# EAGLE design TestShem (EAGLE 9.6.2)
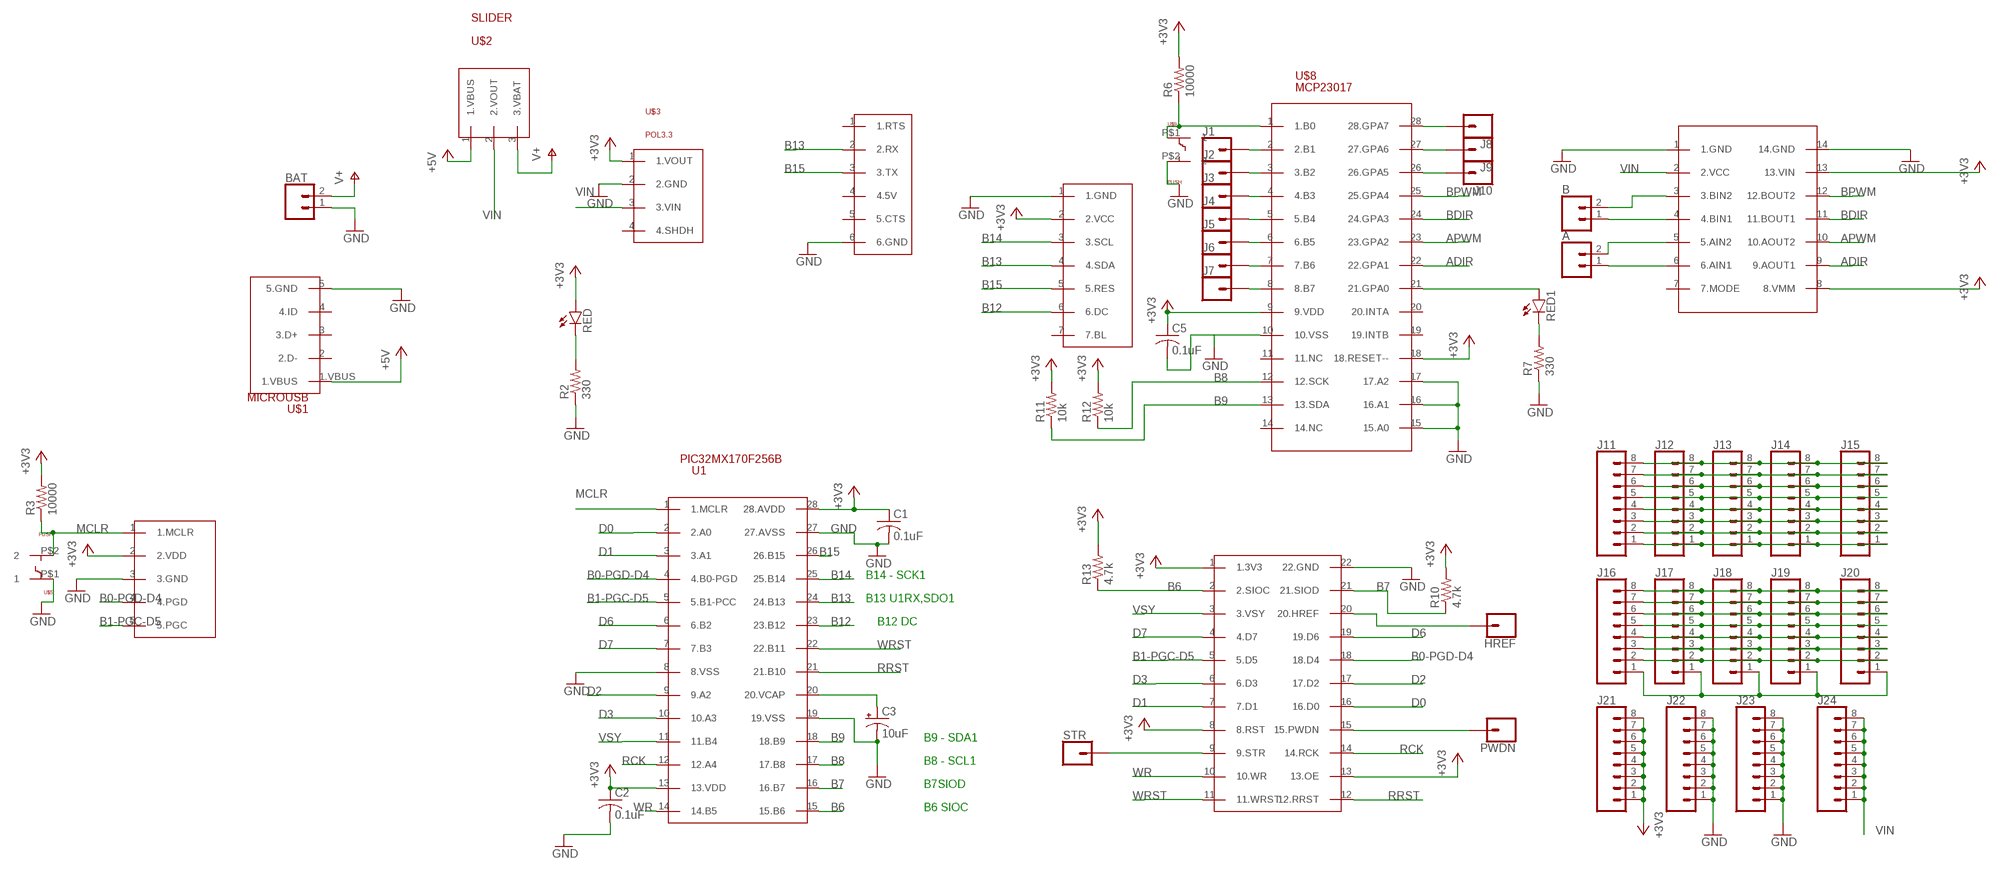
[diagram p0: schematic, sheet 1]

## Parts
A  CONN_02  [1X02]
B  CONN_02  [1X02]
BAT  CONN_02  [1X02]
C1  0.1uF  C-US025-030X050  [C025-030X050]
C2  0.1uF  C-US025-030X050  [C025-030X050]
C3  10uF  CPOL-USB45181B  [B45181B]
C5  0.1uF  C-US025-030X050  [C025-030X050]
HREF  CONN_01  [1X01]
J1  CONN_01  [1X01]
J2  CONN_01  [1X01]
J3  CONN_01  [1X01]
J4  CONN_01  [1X01]
J5  CONN_01  [1X01]
J6  CONN_01  [1X01]
J7  CONN_01  [1X01]
J8  CONN_01  [1X01]
J9  CONN_01  [1X01]
J10  CONN_01  [1X01]
J11  CONN_08"  [1X08]
J12  CONN_08"  [1X08]
J13  CONN_08"  [1X08]
J14  CONN_08"  [1X08]
J15  CONN_08"  [1X08]
J16  CONN_08"  [1X08]
J17  CONN_08"  [1X08]
J18  CONN_08"  [1X08]
J19  CONN_08"  [1X08]
J20  CONN_08"  [1X08]
J21  CONN_08"  [1X08]
J22  CONN_08"  [1X08]
J23  CONN_08"  [1X08]
J24  CONN_08"  [1X08]
PWDN  CONN_01  [1X01]
R2  330  R-US_0207/10  [0207/10]
R3  10000  R-US_0207/10  [0207/10]
R6  10000  R-US_0207/10  [0207/10]
R7  330  R-US_0207/10  [0207/10]
R10  4.7k  R-US_0207/10  [0207/10]
R11  10k  R-US_0207/10  [0207/10]
R12  10k  R-US_0207/10  [0207/10]
R13  4.7k  R-US_0207/10  [0207/10]
RED  LED3MM  [LED3MM]
RED1  LED3MM  [LED3MM]
STR  CONN_01  [1X01]
U1  PIC32MX170F256B  [DIL28-3]
U$1  MICROUSB  [MICROUSB]
U$2  SLIDER  [SLIDER]
U$3  POL3.3  [POLOLU3.3]
U$4  SNAP  [1X05]
U$5  PUSH  [PUSH]
U$6  ADACP2104  [1X06V2]
U$7  ST7789  [1X07]
U$8  MCP23017  [DIL28-3]
U$9  PUSH  [PUSH]
U$10  POLOLUDRV8835V2  [1X07V2]
U$11  OV7670CAMFIXED  [1X02CAM]

## Nets
10.VSS: C5.2 U$8.10(10.VSS)
+3V3: C1.1 C2.1 C5.1 J21.1 J21.2 J21.3 J21.4 J21.5 J21.6 J21.7 J21.8 R3.2 R6.2 R10.2 R11.2 R12.2 R13.2 RED.A U1.13(13.VDD) U1.28(28.AVDD) U$3.1(1.VOUT) U$4.2(2.VDD) U$7.2(2.VCC) U$8.9(9.VDD) U$8.18(18.RESET--) U$10.8(8.VMM) U$10.13(13.VIN) U$11.1(1.3V3) U$11.8(8.RST) U$11.13(13.OE)
+5V: U$1.1.VBUS U$2.1(1.VBUS)
ADIR: U$8.22(22.GPA1) U$10.9(9.AOUT1)
APWM: U$8.23(23.GPA2) U$10.10(10.AOUT2)
B0-PGD-D4: U1.4(4.B0-PGD) U$4.4(4.PGD) U$11.18(18.D4)
B1-PGC-D5: U1.5(5.B1-PCC) U$4.5(5.PGC) U$11.5(5.D5)
B6: R13.1 U1.15(15.B6) U$11.2(2.SIOC)
B7: R10.1 U1.16(16.B7) U$11.21(21.SIOD)
B8: R12.1 U1.17(17.B8) U$8.12(12.SCK)
B9: R11.1 U1.18(18.B9) U$8.13(13.SDA)
B12: U1.23(23.B12) U$7.6(6.DC)
B13: U1.24(24.B13) U$6.2(2.RX) U$7.4(4.SDA)
B14: U1.25(25.B14) U$7.3(3.SCL)
B15: U1.26(26.B15) U$6.3(3.TX) U$7.5(5.RES)
BDIR: U$8.24(24.GPA3) U$10.11(11.BOUT1)
BPWM: U$8.25(25.GPA4) U$10.12(12.BOUT2)
D0: U1.2(2.A0) U$11.16(16.D0)
D1: U1.3(3.A1) U$11.7(7.D1)
D2: U1.9(9.A2) U$11.17(17.D2)
D3: U1.10(10.A3) U$11.6(6.D3)
D6: U1.6(6.B2) U$11.19(19.D6)
D7: U1.7(7.B3) U$11.4(4.D7)
GND: BAT.1 C1.2 C2.2 C3.- J22.1 J22.2 J22.3 J22.4 J22.5 J22.6 J22.7 J22.8 J23.1 J23.2 J23.3 J23.4 J23.5 J23.6 J23.7 J23.8 R2.1 R7.1 U1.8(8.VSS) U1.19(19.VSS) U1.27(27.AVSS) U$1.5(5.GND) U$3.2(2.GND) U$4.3(3.GND) U$5.P$1 U$6.6(6.GND) U$7.1(1.GND) U$8.15(15.A0) U$8.16(16.A1) U$8.17(17.A2) U$9.P$2 U$10.1(1.GND) U$10.14(14.GND) U$11.22(22.GND)
MCLR: R3.1 U1.1(1.MCLR) U$4.1(1.MCLR) U$5.P$2
N$1: R2.2 RED.K(C)
N$2: R6.1 U$8.1(1.B0) U$9.P$1
N$3: RED1.A U$8.21(21.GPA0)
N$4: C3.+ U1.20(20.VCAP)
N$5: R7.2 RED1.K(C)
N$6: B.2 U$10.3(3.BIN2)
N$7: B.1 U$10.4(4.BIN1)
N$8: A.2 U$10.5(5.AIN2)
N$9: A.1 U$10.6(6.AIN1)
N$10: PWDN.1 U$11.15(15.PWDN)
N$11: HREF.1 U$11.20(20.HREF)
N$12: STR.1 U$11.9(9.STR)
N$13: J1.1 U$8.2(2.B1)
N$14: J2.1 U$8.3(3.B2)
N$15: J3.1 U$8.4(4.B3)
N$16: J4.1 U$8.5(5.B4)
N$17: J5.1 U$8.6(6.B5)
N$18: J6.1 U$8.7(7.B6)
N$19: J7.1 U$8.8(8.B7)
N$20: J8.1 U$8.28(28.GPA7)
N$21: J9.1 U$8.27(27.GPA6)
N$22: J10.1 U$8.26(26.GPA5)
N$23: J11.8 J12.8 J13.8 J14.8 J15.8
N$24: J11.7 J12.7 J13.7 J14.7 J15.7
N$25: J11.6 J12.6 J13.6 J14.6 J15.6
N$26: J11.5 J12.5 J13.5 J14.5 J15.5
N$27: J11.4 J12.4 J13.4 J14.4 J15.4
N$28: J11.3 J12.3 J13.3 J14.3 J15.3
N$29: J11.2 J12.2 J13.2 J14.2 J15.2
N$30: J11.1 J12.1 J13.1 J14.1 J15.1
N$31: J16.8 J17.8 J18.8 J19.8 J20.8
N$32: J16.7 J17.7 J18.7 J19.7 J20.7
N$33: J16.6 J17.6 J18.6 J19.6 J20.6
N$34: J16.5 J17.5 J18.5 J19.5 J20.5
N$35: J16.4 J17.4 J18.4 J19.4 J20.4
N$36: J16.3 J17.3 J18.3 J19.3 J20.3
N$37: J16.2 J17.2 J18.2 J19.2 J20.2
N$38: J16.1 J17.1 J18.1 J19.1 J20.1
RCK: U1.12(12.A4) U$11.14(14.RCK)
RRST: U1.21(21.B10) U$11.12(12.RRST)
V+: BAT.2 U$2.3(3.VBAT)
VIN: J24.1 J24.2 J24.3 J24.4 J24.5 J24.6 J24.7 J24.8 U$2.2(2.VOUT) U$3.3(3.VIN) U$10.2(2.VCC)
VSY: U1.11(11.B4) U$11.3(3.VSY)
WR: U1.14(14.B5) U$11.10(10.WR)
WRST: U1.22(22.B11) U$11.11(11.WRST)
Unconnected: U$1.2(2.D-) U$1.3(3.D+) U$1.4(4.ID) U$3.4(4.SHDH) U$6.1(1.RTS) U$6.4(4.5V) U$6.5(5.CTS) U$7.7(7.BL) U$8.11(11.NC) U$8.14(14.NC) U$8.19(19.INTB) U$8.20(20.INTA) U$10.7(7.MODE)

## Notes on the sheet
- B14 - SCK1
- B13 U1RX,SDO1
- B12 DC
- B9 - SDA1
- B8 - SCL1
- B7SIOD
- B6 SIOC

## Library data of the parts
A B BAT = Me433lib:CONN_02: Multi connection point. Often used as Generic Header-pin footprint for 0.1 inch spaced/style header connections On any of the 0.1 inch spaced packages, you can populate with these: Break Away Headers - Straight <https://www.sparkfun.com/products/116> (PRT-00116) Break Away Male Headers - Right Angle <https://www.sparkfun.com/products/553> (PRT-00553) Female Headers <https://www.sparkfun.com/products/115> (PRT-00115) Break Away Headers - Machine Pin <https://www.sparkfun.com/products/117> (PRT-00117) Break Away Female Headers - Swiss Machine Pin <https://www.sparkfun.com/products/743> (PRT-00743) For SCREWTERMINALS and SPRING TERMINALS visit here: Screw Terimnals on SparkFun.com <https://www.sparkfun.com/search/results?term=Screw+Terminals> (5mm/3.5mm/2.54mm spacing) This device is also useful as a general connection point to wire up your design to another part of your project. Our various solder wires solder well into these plated through hole pads. Hook-Up Wire - Assortment (Stranded, 22 AWG) <https://www.sparkfun.com/products/11375> (PRT-11375) Hook-Up Wire - Assortment (Solid Core, 22 AWG) <https://www.sparkfun.com/products/11367> (PRT-11367) View the entire wire category on our website here <https://www.sparkfun.com/categories/141> Special notes: Molex polarized connector foot print use with: PRT-08233 with associated crimp pins and housings. 2.54_SCREWTERM for use with PRT-10571. 3.5mm Screw Terminal footprints for PRT-08084 5mm Screw Terminal footprints for use with PRT-08432
C1 C2 C5 = Me433lib:C-US: CAPACITOR, American symbol; SPICEPREFIX: C
C3 = Me433lib:CPOL-US: POLARIZED CAPACITOR, American symbol; SPICEPREFIX: C
HREF J1-J10 PWDN STR = Me433lib:CONN_01: Single connection point. Often used as Generic Header-pin footprint for 0.1 inch spaced/style header connections On any of the 0.1 inch spaced packages, you can populate with these: Break Away Headers - Straight <https://www.sparkfun.com/products/116> (PRT-00116) Break Away Male Headers - Right Angle <https://www.sparkfun.com/products/553> (PRT-00553) Female Headers <https://www.sparkfun.com/products/115> (PRT-00115) Break Away Headers - Machine Pin <https://www.sparkfun.com/products/117> (PRT-00117) Break Away Female Headers - Swiss Machine Pin <https://www.sparkfun.com/products/743> (PRT-00743) This device is also useful as a general connection point to wire up your design to another part of your project. Our various solder wires solder well into these plated through hole pads. Hook-Up Wire - Assortment (Stranded, 22 AWG) <https://www.sparkfun.com/products/11375> (PRT-11375) Hook-Up Wire - Assortment (Solid Core, 22 AWG) <https://www.sparkfun.com/products/11367> (PRT-11367) View the entire wire category on our website here <https://www.sparkfun.com/categories/141> Special notes: SMTSO-256-ET is a "flush mount" nut for a 4-40 screw. We mostly use this on specialty testbeds; it is a nice way to connect hardware to your PCB at an adjustable hieght. Also note, the SNAP packages are for using a snappable style connector. We sell a baggie of snaps and they are also used on two LilyPad designs: Snap Assortment - 30 pack (male and female) <https://www.sparkfun.com/products/11347> (DEV-11347) LilyPad Arduino SimpleSnap <https://www.sparkfun.com/products/10941> (DEV-10941) LilyPad SimpleSnap Protoboard <https://www.sparkfun.com/products/10940> (DEV-10940)
J11-J24 = Me433lib:CONN_08: Multi connection point. Often used as Generic Header-pin footprint for 0.1 inch spaced/style header connections On any of the 0.1 inch spaced packages, you can populate with these: Break Away Headers - Straight <https://www.sparkfun.com/products/116> (PRT-00116) Break Away Male Headers - Right Angle <https://www.sparkfun.com/products/553> (PRT-00553) Female Headers <https://www.sparkfun.com/products/115> (PRT-00115) Break Away Headers - Machine Pin <https://www.sparkfun.com/products/117> (PRT-00117) Break Away Female Headers - Swiss Machine Pin <https://www.sparkfun.com/products/743> (PRT-00743) Arduino Stackable Header - 8 Pin <https://www.sparkfun.com/products/9279> (PRT-09279) For SCREWTERMINALS and SPRING TERMINALS visit here: Screw Terimnals on SparkFun.com <https://www.sparkfun.com/search/results?term=Screw+Terminals> (5mm/3.5mm/2.54mm spacing) This device is also useful as a general connection point to wire up your design to another part of your project. Our various solder wires solder well into these plated through hole pads. Hook-Up Wire - Assortment (Stranded, 22 AWG) <https://www.sparkfun.com/products/11375> (PRT-11375) Hook-Up Wire - Assortment (Solid Core, 22 AWG) <https://www.sparkfun.com/products/11367> (PRT-11367) View the entire wire category on our website here <https://www.sparkfun.com/categories/141> Special notes: Molex polarized connector foot print use with SKU : PRT-08231 with associated crimp pins and housings. 1MM SMD Version SKU: PRT-10208 NOTES ON THE VARIANTS LOCK and LOCK_LONGPADS... This footprint was designed to help hold the alignment of a through-hole component (i.e. 6-pin header) while soldering it into place. You may notice that each hole has been shifted either up or down by 0.005 of an inch from it's more standard position (which is a perfectly straight line). This slight alteration caused the pins (the squares in the middle) to touch the edges of the holes. Because they are alternating, it causes a "brace" to hold the component in place. 0.005 has proven to be the perfect amount of "off-center" position when using our standard breakaway headers. Although looks a little odd when you look at the bare footprint, once you have a header in there, the alteration is very hard to notice. Also,if you push a header all the way into place, it is covered up entirely on the bottom side.; PROD_ID: CONN-08438
R2 R3 R6 R7 R10-R13 = Me433lib:R-US_: RESISTOR, American symbol; SPICEPREFIX: R
RED RED1 = Me433lib:LED: LED OSRAM: - CHIPLED LG R971, LG N971, LY N971, LG Q971, LY Q971, LO R971, LY R971 LH N974, LH R974 LS Q976, LO Q976, LY Q976 LO Q996 - Hyper CHIPLED LW Q18S LB Q993, LB Q99A, LB R99A - SideLED LS A670, LO A670, LY A670, LG A670, LP A670 LB A673, LV A673, LT A673, LW A673 LH A674 LY A675 LS A676, LA A676, LO A676, LY A676, LW A676 LS A679, LY A679, LG A679 - Hyper Micro SIDELED® LS Y876, LA Y876, LO Y876, LY Y876 LT Y87S - SmartLED LW L88C, LW L88S LB L89C, LB L89S, LG L890 LS L89K, LO L89K, LY L89K LS L896, LA L896, LO L896, LY L896 - TOPLED LS T670, LO T670, LY T670, LG T670, LP T670 LSG T670, LSP T670, LSY T670, LOP T670, LYG T670 LG T671, LOG T671, LSG T671 LB T673, LV T673, LT T673, LW T673 LH T674 LS T676, LA T676, LO T676, LY T676, LB T676, LH T676, LSB T676, LW T676 LB T67C, LV T67C, LT T67C, LS T67K, LO T67K, LY T67K, LW E67C LS E67B, LA E67B, LO E67B, LY E67B, LB E67C, LV E67C, LT E67C LW T67C LS T679, LY T679, LG T679 LS T770, LO T770, LY T770, LG T770, LP T770 LB T773, LV T773, LT T773, LW T773 LH T774 LS E675, LA E675, LY E675, LS T675 LS T776, LA T776, LO T776, LY T776, LB T776 LHGB T686 LT T68C, LB T68C - Hyper Mini TOPLED® LB M676 - Mini TOPLED Santana® LG M470 LS M47K, LO M47K, LY M47K Source: http://www.osram.convergy.de LUXEON: - LUMILED® LXK2-PW12-R00, LXK2-PW12-S00, LXK2-PW14-U00, LXK2-PW14-V00 LXK2-PM12-R00, LXK2-PM12-S00, LXK2-PM14-U00 LXK2-PE12-Q00, LXK2-PE12-R00, LXK2-PE12-S00, LXK2-PE14-T00, LXK2-PE14-U00 LXK2-PB12-K00, LXK2-PB12-L00, LXK2-PB12-M00, LXK2-PB14-N00, LXK2-PB14-P00, LXK2-PB14-Q00 LXK2-PR12-L00, LXK2-PR12-M00, LXK2-PR14-Q00, LXK2-PR14-R00 LXK2-PD12-Q00, LXK2-PD12-R00, LXK2-PD12-S00 LXK2-PH12-R00, LXK2-PH12-S00 LXK2-PL12-P00, LXK2-PL12-Q00, LXK2-PL12-R00 Source: www.luxeon.com KINGBRIGHT: KA-3528ASYC Source: www.kingbright.com
U1 = Me433lib:PIC32MX170F256B
U$1 = Me433lib:MICROUSB
U$2 = Me433lib:SLIDER
U$3 = Me433lib:POL3.3
U$4 = Me433lib:SNAP
U$5 U$9 = Me433lib:PUSH
U$6 = Me433lib:ADACP2104
U$7 = Me433lib:ST7789
U$8 = Me433lib:MCP23017
U$10 = Me433lib:POLOLUDRV8835V2
U$11 = Me433lib:OV7670CAMFIXED

## Board
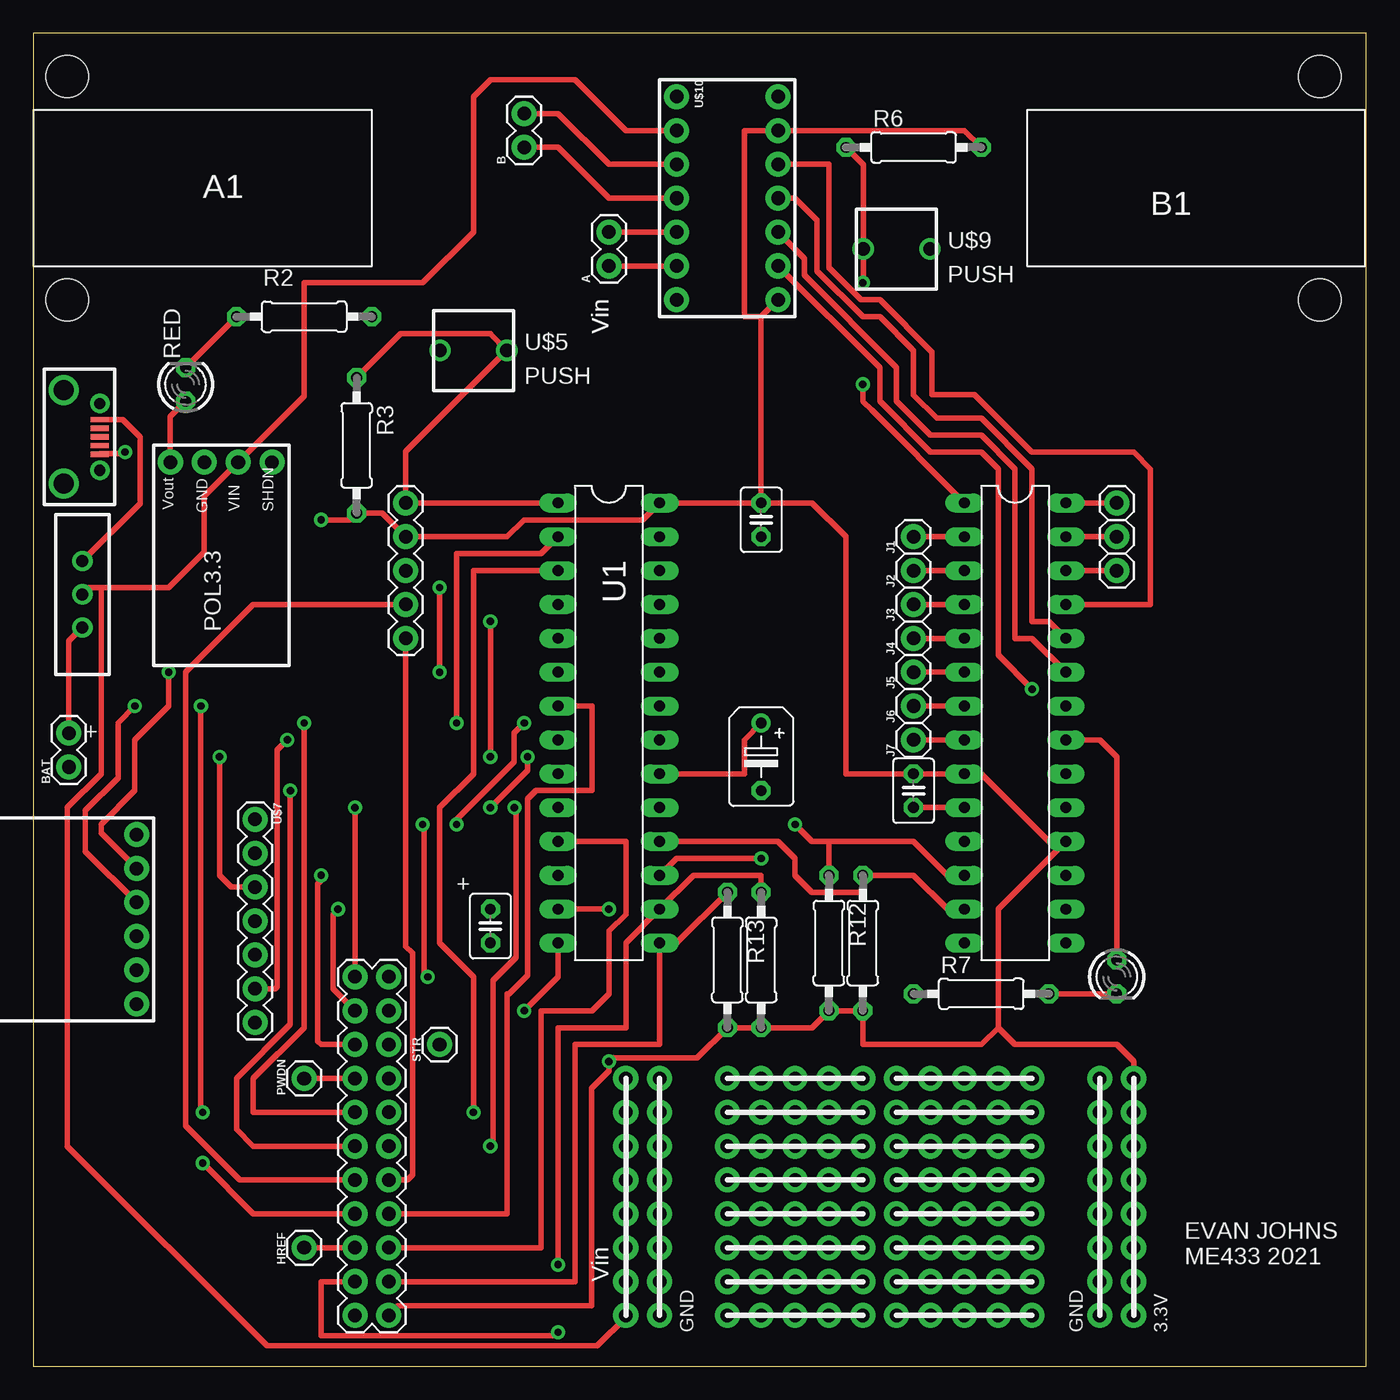
[diagram p1: board, top side]
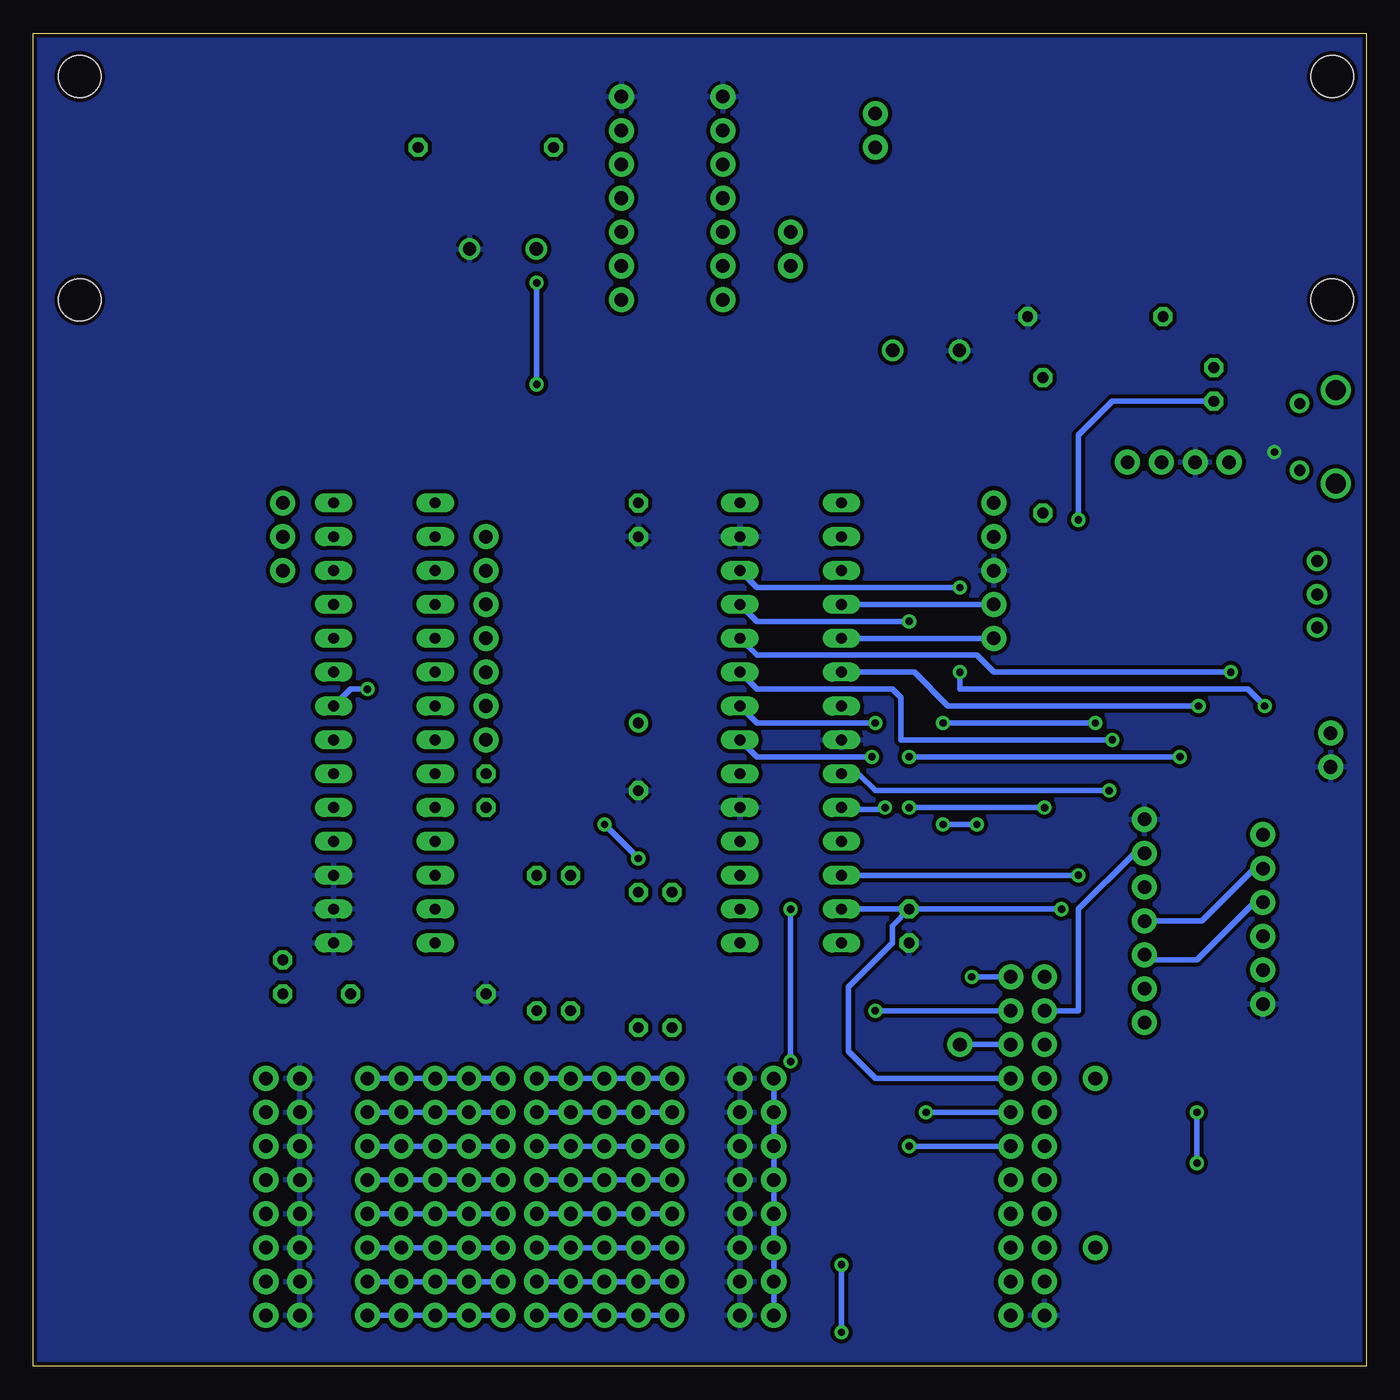
[diagram p2: board, bottom side, seen from below]

Size 100 x 100 mm. Coordinates in mm from the lower left corner, seen from the top.
Outline: 0,0 100,0 100,100 0,100 0,0
Copper layers (1*16): Top 0.035mm / dielectric 1.5mm / Bottom 0.035mm
Design rules "SparkFun": minimum track width 8mil, minimum drill 20mil, track to track 8mil, track to pad 8mil, pad to pad 8mil, via to via 8mil, smd to smd 8mil, copper to edge 8mil, drill to drill 8mil, minimum pad ring 12mil, minimum via ring 10mil, stop-mask expansion 4mil, vias tented up to drill 20mil, thermal gap 10mil
Holes 3.17 mm at 2.54,96.77 2.54,80.01 96.52,96.77 96.52,80.01

### Footprints (pad centres in the part's own frame; a part is rotated, then mirrored left to right if it is on the bottom)
1X02 = drill 1.016 pad 1.88: 1 0,0; 2 2.54,0
C025-030X050 = drill 0.813 octagon: 1 -1.27,0; 2 1.27,0
B45181B = drill 0.813: + -2.54,0 | drill 0.813 octagon: - 2.54,0
1X01 = drill 1.016 pad 1.88: 1 0,0
1X08 = drill 1.016 pad 1.88: 1 0,0; 2 2.54,0; 3 5.08,0; 4 7.62,0; 5 10.16,0; 6 12.7,0; 7 15.24,0; 8 17.78,0
0207/10 = drill 0.813 octagon: 1 -5.08,0; 2 5.08,0
LED3MM = drill 0.813 octagon: A -1.27,0; K 1.27,0
DIL28-3 = drill 0.813 long: 1 -16.51,-3.81; 2 -13.97,-3.81; 3 -11.43,-3.81; 4 -8.89,-3.81; 5 -6.35,-3.81; 6 -3.81,-3.81; 7 -1.27,-3.81; 8 1.27,-3.81; 9 3.81,-3.81; 10 6.35,-3.81; 11 8.89,-3.81; 12 11.43,-3.81; 13 13.97,-3.81; 14 16.51,-3.81; 15 16.51,3.81; 16 13.97,3.81; 17 11.43,3.81; 18 8.89,3.81; 19 6.35,3.81; 20 3.81,3.81; 21 1.27,3.81; 22 -1.27,3.81; 23 -3.81,3.81; 24 -6.35,3.81; 25 -8.89,3.81; 26 -11.43,3.81; 27 -13.97,3.81; 28 -16.51,3.81
MICROUSB = smd 0.4 x 1.35: 1.VBUS -1.3,2.7; 2 -0.65,2.7; 3 0,2.7; 4 0.65,2.7; 5 1.3,2.7 | drill 0.85: P$6 -2.5,2.7; P$7 2.5,2.7 | drill 1.5: P$8 -3.5,0; P$9 3.5,0
SLIDER = drill 0.9: 1 -2.5,0; 2 0,0; 3 2.5,0
POLOLU3.3 = drill 1.016 pad 1.88: 1 0,1.27; 2 0,-1.27; 3 0,-3.81; 4 0,-6.35
1X05 = drill 1.016 pad 1.88: 1 0,0; 2 0,-2.54; 3 0,-5.08; 4 0,-7.62; 5 0,-10.16
PUSH = drill 1: P$1 -2.5,0; P$2 2.5,0
1X06V2 = drill 1.016 pad 1.88: 1 0,0; 2 0,-2.54; 3 0,-5.08; 4 0,-7.62; 5 0,-10.16; 6 0,-12.7
1X07 = drill 1.016 pad 1.88: 1 0,0; 2 0,-2.54; 3 0,-5.08; 4 0,-7.62; 5 0,-10.16; 6 0,-12.7; 7 0,-15.24
1X07V2 = drill 1.016 pad 1.88: 1 0,0; 2 0,-2.54; 3 0,-5.08; 4 0,-7.62; 5 0,-10.16; 6 0,-12.7; 7 0,-15.24; 8 7.62,-15.24; 9 7.62,-12.7; 10 7.62,-10.16; 11 7.62,-7.62; 12 7.62,-5.08; 13 7.62,-2.54; 14 7.62,0
1X02CAM = drill 1.016 pad 1.88: 1 0,0; 2 2.54,0; 3 5.08,0; 4 7.62,0; 5 10.16,0; 6 12.7,0; 7 15.24,0; 8 17.78,0; 9 20.32,0; 10 22.86,0; 11 25.4,0; 12 25.4,2.54; 13 22.86,2.54; 14 20.32,2.54; 15 17.78,2.54; 16 15.24,2.54; 17 12.7,2.54; 18 10.16,2.54; 19 7.62,2.54; 20 5.08,2.54; 21 2.54,2.54; 22 0,2.54

### Placement (x,y rotation side)
A  43.18,82.55 90 top
B  36.83,91.44 90 top
BAT  2.67,44.96 90 top
C1  54.61,63.5 270 top
C2  34.29,33.02 270 top
C3  54.61,45.72 270 top
C5  66.04,43.18 270 top
HREF  20.32,8.89 90 top
J1  66.04,62.23 90 top
J2  66.04,59.69 90 top
J3  66.04,57.15 90 top
J4  66.04,54.61 90 top
J5  66.04,52.07 90 top
J6  66.04,49.53 90 top
J7  66.04,46.99 90 top
J8  81.28,64.77 90 top
J9  81.28,62.23 90 top
J10  81.28,59.69 90 top
J11  52.07,3.81 90 top
J12  54.61,3.81 90 top
J13  57.15,3.81 90 top
J14  59.69,3.81 90 top
J15  62.23,3.81 90 top
J16  64.77,3.81 90 top
J17  67.31,3.81 90 top
J18  69.85,3.81 90 top
J19  72.39,3.81 90 top
J20  74.93,3.81 90 top
J21  82.55,3.81 90 top
J22  46.99,3.81 90 top
J23  80.01,3.81 90 top
J24  44.45,3.81 90 top
PWDN  20.32,21.59 90 top
R2  20.32,78.74 180 top
R3  24.26,69.09 270 top
R6  66.04,91.44 0 top
R7  71.12,27.94 0 top
R10  54.61,30.48 270 top
R11  62.23,31.75 270 top
R12  59.69,31.75 270 top
R13  52.07,30.48 270 top
RED  11.43,73.66 90 top
RED1  81.28,29.21 270 top
STR  30.48,24.13 90 top
U1  43.18,48.26 270 top
U$1  2.29,69.72 270 top
U$2  3.68,57.91 270 top
U$3  11.56,67.82 90 top
U$4  27.94,64.77 0 top
U$5  33.02,76.2 0 top
U$6  7.75,39.88 0 top
U$7  16.64,41.02 0 top
U$8  73.66,48.26 270 top
U$9  64.77,83.82 0 top
U$10  48.26,95.25 0 top
U$11  26.67,3.81 90 top

### Tracks (layer width: path | path; a pad name or v marks a point on that pad's centre or on a via)
10.VSS
  Top 0.406: U$8.10 C5.2
+3V3  (via drill 0.55, 0.55 pad 0.55)
  Top 0.406: U$3.1 10.29,71.25 RED.A | v21.59,63.5 23.75,63.5 R3.2 26.16,64.01 U$4.2 35.56,62.23 36.83,63.5 45.72,63.5 U1.28 C1.1 | C1.1 54.61,78.74 | U$10.8 54.61,78.74 | 54.61,78.74 53.34,78.74 53.34,92.71 U$10.13 69.85,92.71 R6.2 | C1.1 58.42,64.77 60.96,62.23 60.96,44.45 C5.1 U$8.9 71.12,44.45 76.2,39.37 U$8.18 72.39,34.29 72.39,25.4 | 72.39,25.4 73.66,24.13 81.28,24.13 82.55,22.86 J21.8 J21.7 J21.6 J21.5 J21.4 J21.3 J21.2 J21.1 | 72.39,25.4 71.12,24.13 62.23,24.13 R11.2 R12.2 58.42,25.4 R10.2 R13.2 49.78,23.11 43.43,23.11 v43.18,22.86 43.18,22.15 41.88,20.86 41.88,4.52 27.38,4.52 U$11.1 | v43.18,34.29 U1.13 | v22.86,34.29 22.48,33.91 22.48,28.32 U$11.13
  Bottom 0.406: v43.18,22.86 v43.18,34.29 | U1.13 C2.1 | U$7.2 17.4,38.48 21.59,34.29 21.59,26.67 U$11.13 | RED.A 19.05,72.39 21.59,69.85 v21.59,63.5 | U$11.8 36.83,21.59 38.86,23.62 38.86,28.45 35.56,31.75 35.56,33.02 C2.1 | C2.1 v22.86,34.29
+5V
  Top 0.406: U$1.1.VBUS 6.7,71.02 8,69.72 8,64.73 U$2.1
ADIR  (via drill 0.55)
  Top 0.406: v74.93,50.8 72.39,53.34 72.39,67.31 71.12,68.58 67.31,68.58 63.5,72.39 63.5,74.93 U$10.9
  Bottom 0.406: v74.93,50.8 76.2,50.8 U$8.22
APWM
  Top 0.406: U$8.23 74.93,54.61 73.66,54.61 73.66,67.31 71.12,69.85 67.31,69.85 64.77,72.39 64.77,74.93 57.86,81.84 57.86,83.11 U$10.10
B0-PGD-D4
  Top 0.406: U$4.4 16.51,57.15 11.43,52.07 11.43,18.03 15.49,13.97 U$11.18
  Bottom 0.406: U$4.4 U1.4
B1-PGC-D5
  Top 0.406: U$11.5 28.07,13.97 28.45,14.35 28.45,30.99 27.94,31.5 U$4.5
  Bottom 0.406: U$4.5 U1.5
B6
  Top 0.406: R13.1 48.26,31.75 U1.15 46.99,24.13 40.64,24.13 40.64,6.35 U$11.2
B7  (via drill 0.55)
  Top 0.406: R10.1 54.61,36.83 49.53,36.83 U1.16 44.45,31.75 44.45,25.4 39.37,25.4 v39.37,7.62 | U$11.21 21.59,6.35 21.59,2.29 39.12,2.29 v39.37,2.54
  Bottom 0.406: v39.37,7.62 v39.37,2.54
B8  (via drill 0.55)
  Top 0.406: U$8.12 68.58,36.83 66.04,39.37 60.96,39.37 59.69,39.37 | 59.69,39.37 R12.1 | U1.17 48.26,38.1 v54.61,38.1 | v57.15,40.64 58.42,39.37 59.69,39.37
  Bottom 0.406: v54.61,38.1 v57.15,40.64
B9
  Top 0.406: U$8.13 68.58,34.29 66.04,36.83 R11.1 62.23,35.56 58.42,35.56 57.15,36.83 57.15,38.1 55.88,39.37 U1.18
B12  (via drill 0.55)
  Top 0.406: v19.05,46.99 18.29,46.23 18.29,28.45 18.16,28.32 U$7.6
  Bottom 0.406: U1.23 45.72,50.8 35.56,50.8 34.92,50.16 34.92,46.99 v19.05,46.99
B13  (via drill 0.55)
  Top 0.406: v10.16,52.07 10.16,49.53 7.62,46.99 7.62,43.18 5.08,40.64 5.08,40.01 U$6.2
  Bottom 0.406: U$6.2 8.38,37.34 12.32,33.4 U$7.4 | U1.24 45.72,53.34 29.21,53.34 27.94,52.07 v10.16,52.07
B14  (via drill 0.55)
  Top 0.406: v34.29,55.88 v34.29,45.72 | v13.97,45.72 13.97,36.83 14.86,35.94 U$7.3
  Bottom 0.406: U1.25 45.72,55.88 v34.29,55.88 | v34.29,45.72 v13.97,45.72
B15  (via drill 0.55)
  Top 0.406: v30.48,58.42 v30.48,52.07 | v7.62,49.53 6.35,48.26 6.35,44.12 3.91,41.69 3.91,38.63 U$6.3
  Bottom 0.406: U$6.3 8.38,34.8 12.7,30.48 16.26,30.48 U$7.5 | U1.26 45.72,58.42 v30.48,58.42 | v30.48,52.07 30.48,50.8 8.89,50.8 v7.62,49.53
BDIR
  Top 0.406: U$8.24 76.2,55.88 74.93,55.88 74.93,67.31 71.12,71.12 67.79,71.12 66.04,72.87 66.04,76.2 63.5,78.74 62.23,78.74 58.8,82.17 58.8,85.98 57.15,87.63 U$10.11
BPWM
  Top 0.406: U$8.25 83.82,57.15 83.82,67.31 82.55,68.58 74.93,68.58 70.61,72.9 67.44,72.9 67.44,76.07 63.5,80.01 62.1,80.01 59.69,82.42 59.69,90.17 U$10.12
D0  (via drill 0.55)
  Top 0.406: U1.2 38.1,60.96 31.75,60.96 v31.75,48.26 | v20.32,48.26 20.32,25.4 16.51,21.59 16.51,19.05 U$11.16
  Bottom 0.406: v31.75,48.26 v20.32,48.26
D1  (via drill 0.55)
  Top 0.406: U1.3 33.02,59.69 33.02,44.45 30.48,41.91 30.48,31.75 33.02,29.21 v33.02,19.05
  Bottom 0.406: U$11.7 v33.02,19.05
D2  (via drill 0.55)
  Top 0.406: v19.28,43.18 19.28,25.63 15.24,21.59 15.24,17.78 16.51,16.51 U$11.17
  Bottom 0.406: U1.9 38.1,44.45 36.83,43.18 v19.28,43.18
D3  (via drill 0.55)
  Top 0.406: v36.1,41.91 36.22,41.78 36.22,30.66 34.49,28.93 34.49,16.71 v34.29,16.51
  Bottom 0.406: U1.10 39.24,41.78 36.2,41.78 36.1,41.88 v36.1,41.91 | v34.29,16.51 U$11.6
D6  (via drill 0.55)
  Top 0.406: v12.57,49.53 12.57,19.18 v12.7,19.05 | v12.7,15.24 16.51,11.43 U$11.19
  Bottom 0.406: U1.6 33.91,52.07 31.37,49.53 v12.57,49.53 | v12.7,19.05 v12.7,15.24
D7
  Top 0.406: U1.7 41.91,49.53 41.91,43.18 37.72,43.18 37.08,42.55 37.08,29.34 35.69,27.94 35.56,27.94 35.56,11.43 U$11.4
GND  (via drill 0.55 pad 0.55)
  Top 0.406: U$1.5 5.02,68.45 6.76,68.45 v6.89,68.58 7.06,68.58
  pour Bottom (isolate 0.305): 0,0 99.95,0 100.08,0.13 100.08,99.95 0,99.95
MCLR
  Top 0.406: U1.1 U$4.1 27.94,68.62 U$5.P$2 34.29,77.43 34.29,77.47 27.56,77.47 R3.1
N$1
  Top 0.406: R2.2 RED.K
N$2  (via drill 0.55)
  Top 0.406: R6.1 62.27,90.13 U$9.P$1 62.27,81.32 v62.23,81.28 | U$8.1 62.87,71.75 62.27,72.35 62.23,72.39 v62.23,73.66
  Bottom 0.406: v62.23,81.28 v62.23,73.66
N$3
  Top 0.406: RED1.A 81.28,45.72 80.01,46.99 U$8.21
N$4
  Top 0.406: C3.+ 53.34,46.99 53.34,44.45 U1.20
N$5
  Top 0.406: R7.2 RED1.K
N$6
  Top 0.406: B.2 39.37,93.98 43.18,90.17 U$10.3
N$7
  Top 0.406: B.1 39.37,91.44 43.18,87.63 U$10.4
N$8
  Top 0.406: A.2 U$10.5
N$9
  Top 0.406: A.1 U$10.6
N$10
  Top 0.406: U$11.15 PWDN.1
N$11
  Top 0.406: U$11.20 HREF.1
N$12
  Bottom 0.406: U$11.9 STR.1
N$13
  Top 0.406: U$8.2 J1.1
N$14
  Top 0.406: U$8.3 J2.1
N$15
  Top 0.406: U$8.4 J3.1
N$16
  Top 0.406: U$8.5 J4.1
N$17
  Top 0.406: U$8.6 J5.1
N$18
  Top 0.406: U$8.7 J6.1
N$19
  Top 0.406: U$8.8 J7.1
N$20
  Top 0.406: U$8.28 J8.1
N$21
  Top 0.406: U$8.27 J9.1
N$22
  Top 0.406: U$8.26 J10.1
N$23
  Bottom 0.406: J11.8 J12.8 J13.8 J14.8 J15.8
N$24
  Bottom 0.406: J11.7 J12.7 J13.7 J14.7 J15.7
N$25
  Bottom 0.406: J11.6 J12.6 J13.6 J14.6 J15.6
N$26
  Bottom 0.406: J11.5 J12.5 J13.5 J14.5 J15.5
N$27
  Bottom 0.406: J11.4 J12.4 J13.4 J14.4 J15.4
N$28
  Bottom 0.406: J11.3 J12.3 J13.3 J14.3 J15.3
N$29
  Bottom 0.406: J11.2 J12.2 J13.2 J14.2 J15.2
N$30
  Bottom 0.406: J11.1 J12.1 J13.1 J14.1 J15.1
N$31
  Bottom 0.406: J16.8 J17.8 J18.8 J19.8 J20.8
N$32
  Bottom 0.406: J16.7 J17.7 J18.7 J19.7 J20.7
N$33
  Bottom 0.406: J16.6 J17.6 J18.6 J19.6 J20.6
N$34
  Bottom 0.406: J16.5 J17.5 J18.5 J19.5 J20.5
N$35
  Bottom 0.406: J16.4 J17.4 J18.4 J19.4 J20.4
N$36
  Bottom 0.406: J16.3 J17.3 J18.3 J19.3 J20.3
N$37
  Bottom 0.406: J16.2 J17.2 J18.2 J19.2 J20.2
N$38
  Bottom 0.406: J16.1 J17.1 J18.1 J19.1 J20.1
RCK  (via drill 0.55)
  Top 0.406: v21.59,36.83 21.59,36.45 21.34,36.2 21.34,24.38 21.59,24.13 U$11.14
  Bottom 0.406: U1.12 v21.59,36.83
RRST  (via drill 0.55)
  Top 0.406: v37.08,45.72 37.08,44.7 v34.29,41.91 | v24.13,41.91 U$11.12
  Bottom 0.406: U1.21 45.72,45.72 v37.08,45.72 | v34.29,41.91 v24.13,41.91
V+
  Top 0.406: BAT.2 2.67,54.4 U$2.3
VIN
  Top 0.406: U$2.2 4.19,58.42 5.08,58.42 | 5.08,58.42 10.16,58.42 12.83,61.09 12.83,65.28 U$3.3 20.32,72.77 20.32,81.28 29.21,81.28 33.02,85.09 33.02,95.25 34.29,96.52 40.64,96.52 44.45,92.71 U$10.2 | 5.08,58.42 5.08,44.45 2.54,41.91 2.54,16.51 17.53,1.52 42.29,1.52 44.45,3.68 J24.1
  Bottom 0.406: J24.8 J24.7 J24.6 J24.5 J24.4 J24.3 J24.2 J24.1
VSY
  Top 0.406: U$11.3 38.1,8.89 38.1,26.67 41.91,26.67 43.18,27.94 43.18,32.64 44.45,33.91 44.45,39.37 U1.11
WR  (via drill 0.55)
  Top 0.406: v36.83,26.67 39.37,29.21 U1.14
  Bottom 0.406: U$11.10 v36.83,26.67
WRST  (via drill 0.55)
  Top 0.406: v36.83,48.26 36.07,47.5 36.07,45.34 31.75,41.02 v31.75,40.64 | v29.21,40.64 29.34,40.51 29.34,29.46 v29.59,29.21
  Bottom 0.406: U1.22 45.72,48.26 v36.83,48.26 | v31.75,40.64 v29.21,40.64 | v29.59,29.21 U$11.11

### Text on the board
tPlace: A1 | B1 | Vin | Vin | + | + | EVAN JOHNS / ME433 2021 | Vin | GND | GND | 3.3V